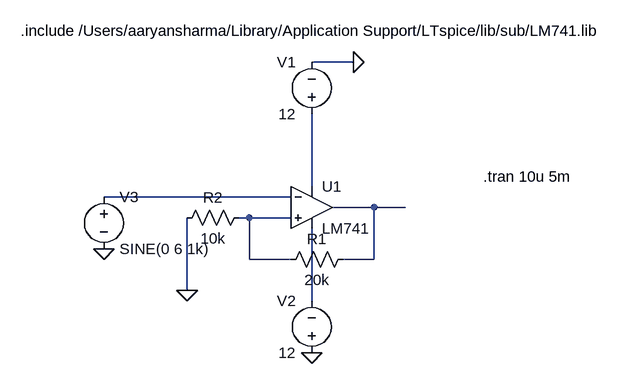
[diagram p0: schematic InvertingSchmittTrigger.asc]
InvertingSchmittTrigger.asc, the LTspice schematic file:
Version 4
SHEET 1 904 680
WIRE 496 112 432 112
WIRE 432 304 432 192
WIRE 400 320 112 320
WIRE 528 336 464 336
WIRE 576 336 528 336
WIRE 336 352 320 352
WIRE 400 352 336 352
WIRE 336 416 336 352
WIRE 400 416 336 416
WIRE 528 416 528 336
WIRE 528 416 480 416
WIRE 240 464 240 352
WIRE 432 480 432 368
FLAG 112 400 0
FLAG 240 464 0
FLAG 432 560 0
FLAG 496 112 0
SYMBOL OpAmps/opamp2 432 272 R0
SYMATTR InstName U1
SYMATTR Value LM741
SYMBOL res 496 400 R90
WINDOW 0 0 56 VBottom 2
WINDOW 3 32 56 VTop 2
SYMATTR InstName R1
SYMATTR Value 20k
SYMBOL res 336 336 R90
WINDOW 0 0 56 VBottom 2
WINDOW 3 32 56 VTop 2
SYMATTR InstName R2
SYMATTR Value 10k
SYMBOL voltage 432 208 R180
WINDOW 0 24 96 Left 2
WINDOW 3 24 16 Left 2
SYMATTR InstName V1
SYMATTR Value 12
SYMBOL voltage 432 576 R180
WINDOW 0 24 96 Left 2
WINDOW 3 24 16 Left 2
SYMATTR InstName V2
SYMATTR Value 12
SYMBOL voltage 112 304 R0
SYMATTR InstName V3
SYMATTR Value SINE(0 6 1k)
TEXT 696 288 Left 2 !.tran 10u 5m
TEXT -16 64 Left 2 !.include /Users/aaryansharma/Library/Application Support/LTspice/lib/sub/LM741.lib

The netlist it stands for:
* InvertingSchmittTrigger.asc
XU1 N004 N002 N001 N005 N003 LM741  ; pins In+ In- V+ V- OUT
R1 N003 N004 20k
R2 N004 0 10k
V1 N001 0 12
V2 0 N005 12
V3 N002 0 SINE(0 6 1k)
.tran 10u 5m
.include /Users/aaryansharma/Library/Application Support/LTspice/lib/sub/LM741.lib
.backanno
.end